# Altium project MotherBoard.PrjPcb
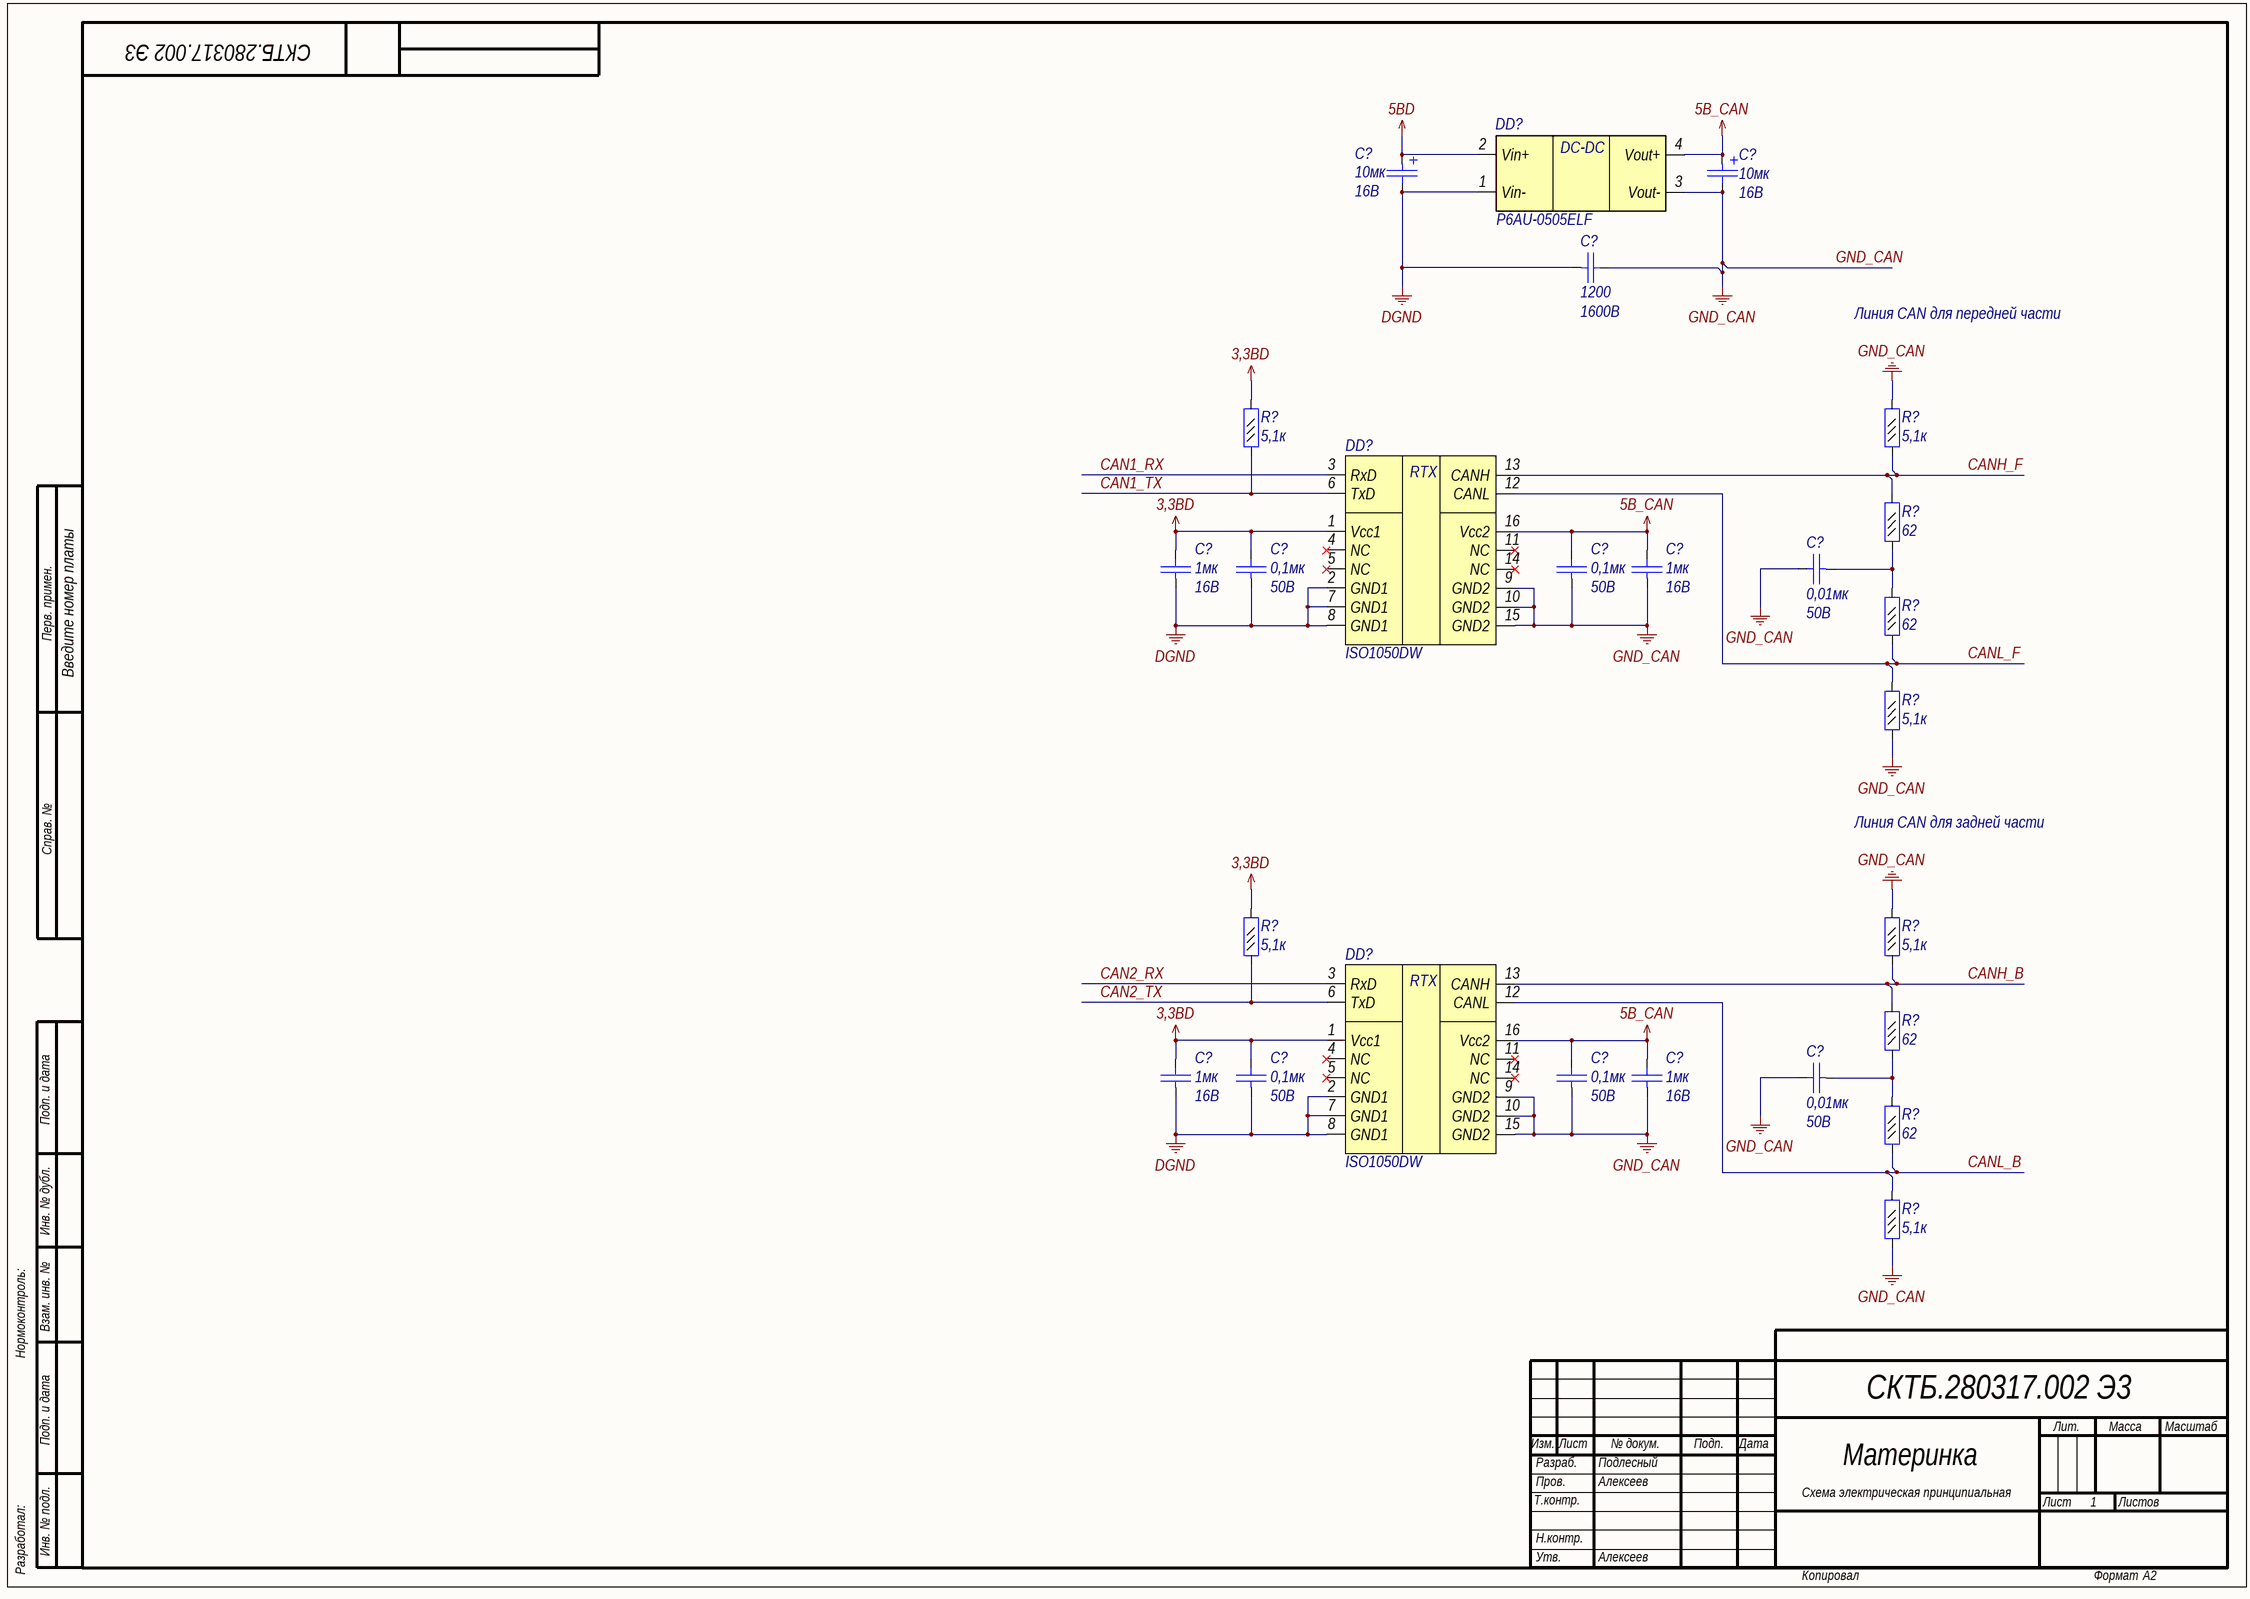
[diagram p0: MotherBoard_CAN.SchDoc]
2 sheets, 30 parts. Net scope: global (net labels, ports and power ports of the same name join across sheets).
Board file: MotherBoard.PcbDoc
Sheets:
  MotherBoard_CAN.SchDoc
  MotherBoard_RASP.SchDoc

## Sheet MotherBoard_CAN.SchDoc: Kapitoshka
size 594 x 420 mm; ApprovedBy: Алексеев; CheckedBy: Алексеев; DrawnBy: Подлесный; DocumentNumber: СКТБ.280317.002 Э3; SheetNumber: 1; Format: A2; DocumentType: Схема электрическая принципиальная; ImagePath: Введите номер платы

### Parts
(Parts that share a designator on the sheet are numbered #1, #2 ... from top to bottom, then left to right.)
C?#1  value 10мк  Voltage: 16В  [TANTAL CASE A]  (hidden comment: Capacitor_pol)
C?#2  value 10мк  Voltage: 16В  [TANTAL CASE A]  (hidden comment: Capacitor_pol)
C?#3  value 1200  Voltage: 1600B  [K78-2]  (hidden comment: Capacitor)
C?#4  value 0,01мк  Voltage: 50B  [C0603]  (hidden comment: Capacitor)
C?#5  value 1мк  Voltage: 16B  [C0603]  (hidden comment: Capacitor)
C?#6  value 0,1мк  Voltage: 50B  [C0603]  (hidden comment: Capacitor)
C?#7  value 0,1мк  Voltage: 50B  [C0603]  (hidden comment: Capacitor)
C?#8  value 1мк  Voltage: 16B  [C0603]  (hidden comment: Capacitor)
C?#9  value 0,01мк  Voltage: 50B  [C0603]  (hidden comment: Capacitor)
C?#10  value 1мк  Voltage: 16B  [C0603]  (hidden comment: Capacitor)
C?#11  value 0,1мк  Voltage: 50B  [C0603]  (hidden comment: Capacitor)
C?#12  value 0,1мк  Voltage: 50B  [C0603]  (hidden comment: Capacitor)
C?#13  value 1мк  Voltage: 16B  [C0603]  (hidden comment: Capacitor)
DD?#1  Part Number: P6AU-0505ELF  [SIP4]  (hidden comment: P6AU-xxxxELF)
DD?#2  (no value)  [SO16]
DD?#3  (no value)  [SO16]
R?#1  value 5,1к  [R0603]  (hidden comment: Resistor_0,062Вт)
R?#2  value 5,1к  [R0603]  (hidden comment: Resistor_0,062Вт)
R?#3  value 62  [R0603]  (hidden comment: Resistor_0,062Вт)
R?#4  value 62  [R0603]  (hidden comment: Resistor_0,062Вт)
R?#5  value 5,1к  [R0603]  (hidden comment: Resistor_0,062Вт)
R?#6  value 5,1к  [R0603]  (hidden comment: Resistor_0,062Вт)
R?#7  value 5,1к  [R0603]  (hidden comment: Resistor_0,062Вт)
R?#8  value 62  [R0603]  (hidden comment: Resistor_0,062Вт)
R?#9  value 62  [R0603]  (hidden comment: Resistor_0,062Вт)
R?#10  value 5,1к  [R0603]  (hidden comment: Resistor_0,062Вт)

### Nets
3,3BD: C?#5.2 C?#6.2 C?#10.2 C?#11.2 DD?#2.1(Vcc1) DD?#3.1(Vcc1) R?#1.2 R?#6.2
5B_CAN: C?#2.1 C?#7.2 C?#8.2 C?#12.2 C?#13.2 DD?#1.4(Vout+) DD?#2.16(Vcc2) DD?#3.16(Vcc2)
5BD: C?#1.1 DD?#1.2(Vin+)
DGND: C?#1.2 C?#3.1 C?#5.1 C?#6.1 C?#10.1 C?#11.1 DD?#1.1(Vin-) DD?#2.2(GND1) DD?#2.7(GND1) DD?#2.8(GND1) DD?#3.2(GND1) DD?#3.7(GND1) DD?#3.8(GND1)
GND_CAN: C?#2.2 C?#3.2 C?#4.2 C?#7.1 C?#8.1 C?#9.2 C?#12.1 C?#13.1 DD?#1.3(Vout-) DD?#2.9(GND2) DD?#2.10(GND2) DD?#2.15(GND2) DD?#3.9(GND2) DD?#3.10(GND2) DD?#3.15(GND2) R?#2.2 R?#5.1 R?#7.2 R?#10.1
CAN1_RX: DD?#2.3(RxD)
CAN1_TX: DD?#2.6(TxD) R?#1.1
CAN2_RX: DD?#3.3(RxD)
CAN2_TX: DD?#3.6(TxD) R?#6.1
CANH_B: DD?#3.13(CANH) R?#7.1 R?#8.2
CANH_F: DD?#2.13(CANH) R?#2.1 R?#3.2
CANL_B: DD?#3.12(CANL) R?#9.1 R?#10.2
CANL_F: DD?#2.12(CANL) R?#4.1 R?#5.2
NetC?#4_1: C?#4.1 R?#3.1 R?#4.2
NetC?#9_1: C?#9.1 R?#8.1 R?#9.2

Not connected (* = marked no-connect by the designer): DD?#2 4(NC)* 5(NC)* 11(NC)* 14(NC)*; DD?#3 4(NC)* 5(NC)* 11(NC)* 14(NC)*

### Notes on the sheet
- Линия CAN для передней части
- Перв. примен.
- Справ. №
- Линия CAN для задней части
- Подп. и дата
- Инв. № дубл.
- Нормоконтроль:
- Взам. инв. №
- Изм.
- Лист
- № докум.
- Подп.
- Дата
- Лит.
- Масса
- Масштаб
- Т.контр.
- Пров.
- Разраб.
- Материнка
- Листов
- Разработал:
- Инв. № подл.
- Н.контр.
- Утв.
- Копировал
- Формат
- (in symbol interf22) RTX
- (in symbol pwr52) DC-DC

### Library data of the parts
C?#1 C?#2 = cap199: Конденсатор полярный; Part Name: Tantal; Manufacture: Vishay; Part Number: 293D106X9016A2TE3; id: cap199
C?#3 = cap276: Конденсатор; Part Name: Film; Manufacture: Россия; Part Number: К78-2-1200пФ-1600В,10%; id: cap276; tga: 0,10%
C?#4 C?#9 = cap124: Конденсатор; Part Name: Ceramic; Manufacture: Murata; Part Number: GRM188R71H103K; id: cap124; TKE: X7R
C?#5 C?#8 C?#10 C?#13 = cap133: Конденсатор; Part Name: Ceramic; Manufacture: Murata; Part Number: GRM188R71C105KA12D**; id: cap133; TKE: X7R
C?#6 C?#7 C?#11 C?#12 = cap131: Конденсатор; Part Name: Ceramic; Manufacture: Murata; Part Number: GRM188R71H104KA93D; id: cap131; TKE: X7R
DD?#1 = pwr52: DC/DC преобразователь; Part Name: DC/DC Converter Isolated; Manufacturer: PEAK Electronics; id: pwr52; Input Voltage: 5B; Current: 200mA; Type: Isolated; Output Voltage: 5B
DD?#2 DD?#3 = interf22: Isolated CAN Transceiver; Manufacture: Texas Instruments; Number of Channel: 1; Type Supply: Single Polar; Current Consumption: 76mA; Power Supply: 3-5,5В/4,75-5,25В; id: interf22; Part Name: Isolated CAN Transceiver; Part Number: ISO1050DW
R?#1 R?#2 R?#5-R?#7 R?#10 = res480: Резистор; Manufacture: Yageo; Part Number: RC0603FR-075K1; id: res480; Accuracy: 0,01; Part Name: Resistor; Power: 0,062Вт
R?#3 R?#4 R?#8 R?#9 = res434: Резистор; Manufacture: Yageo; Part Number: RC0603FR-0762RL; id: res434; Accuracy: 0,01; Part Name: Resistor; Power: 0,062Вт

## Sheet MotherBoard_RASP.SchDoc
size 594 x 420 mm; DocumentNumber: Введите номер платы + Э3; SheetNumber: номер страницы; Format: A2
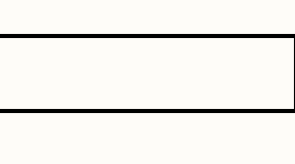
[diagram p1: MotherBoard_RASP.SchDoc, top left]
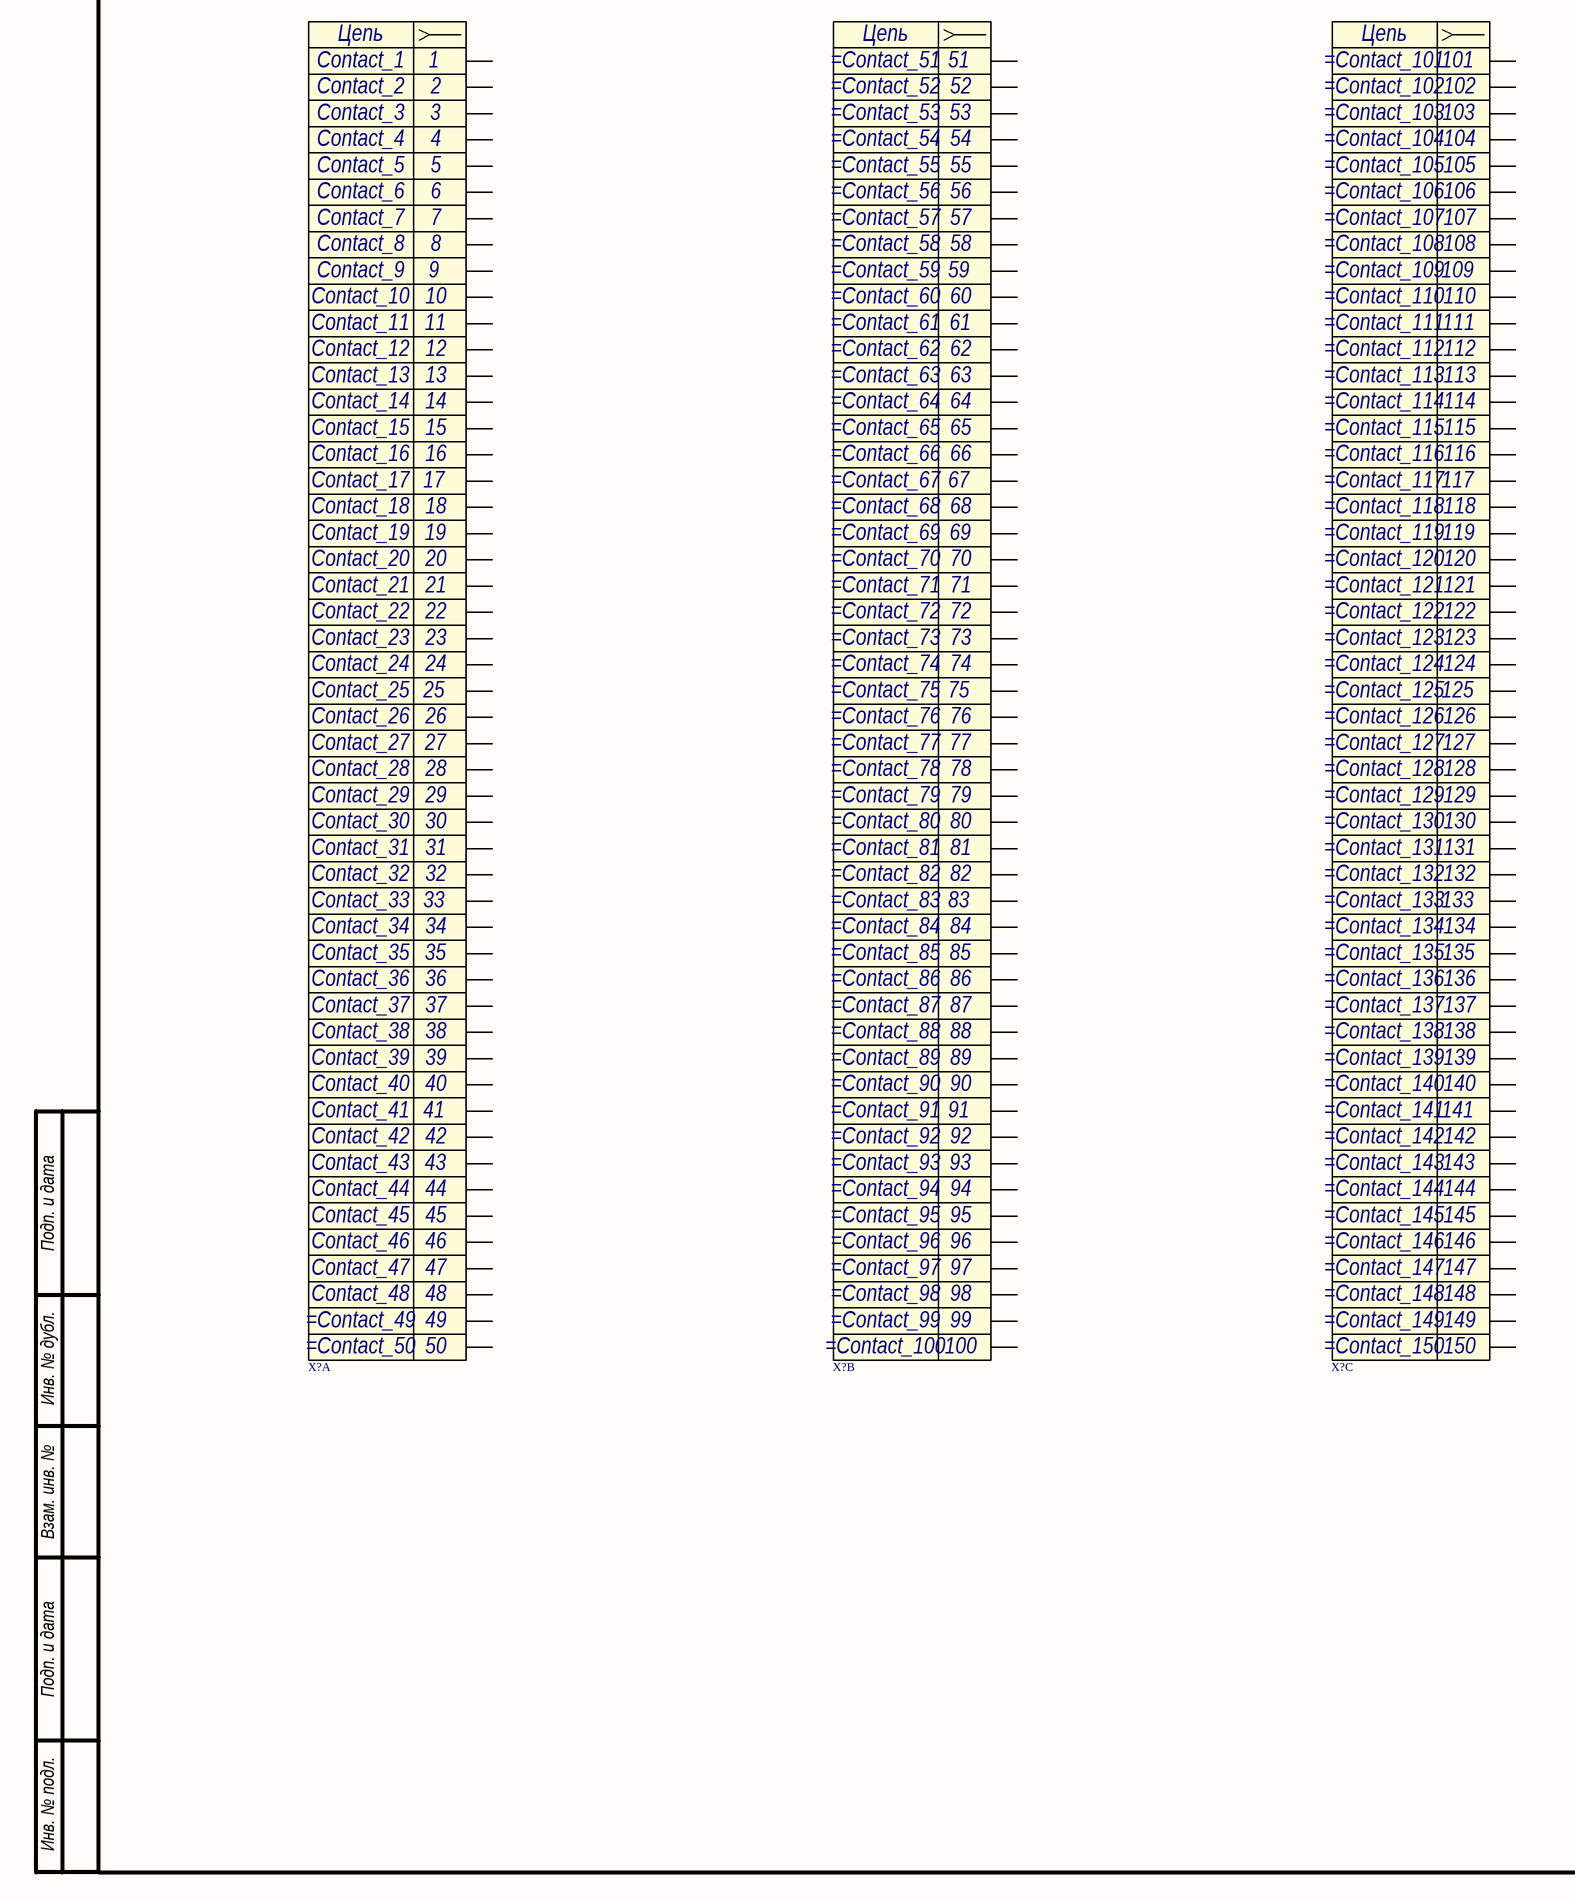
[diagram p2: MotherBoard_RASP.SchDoc, bottom left]
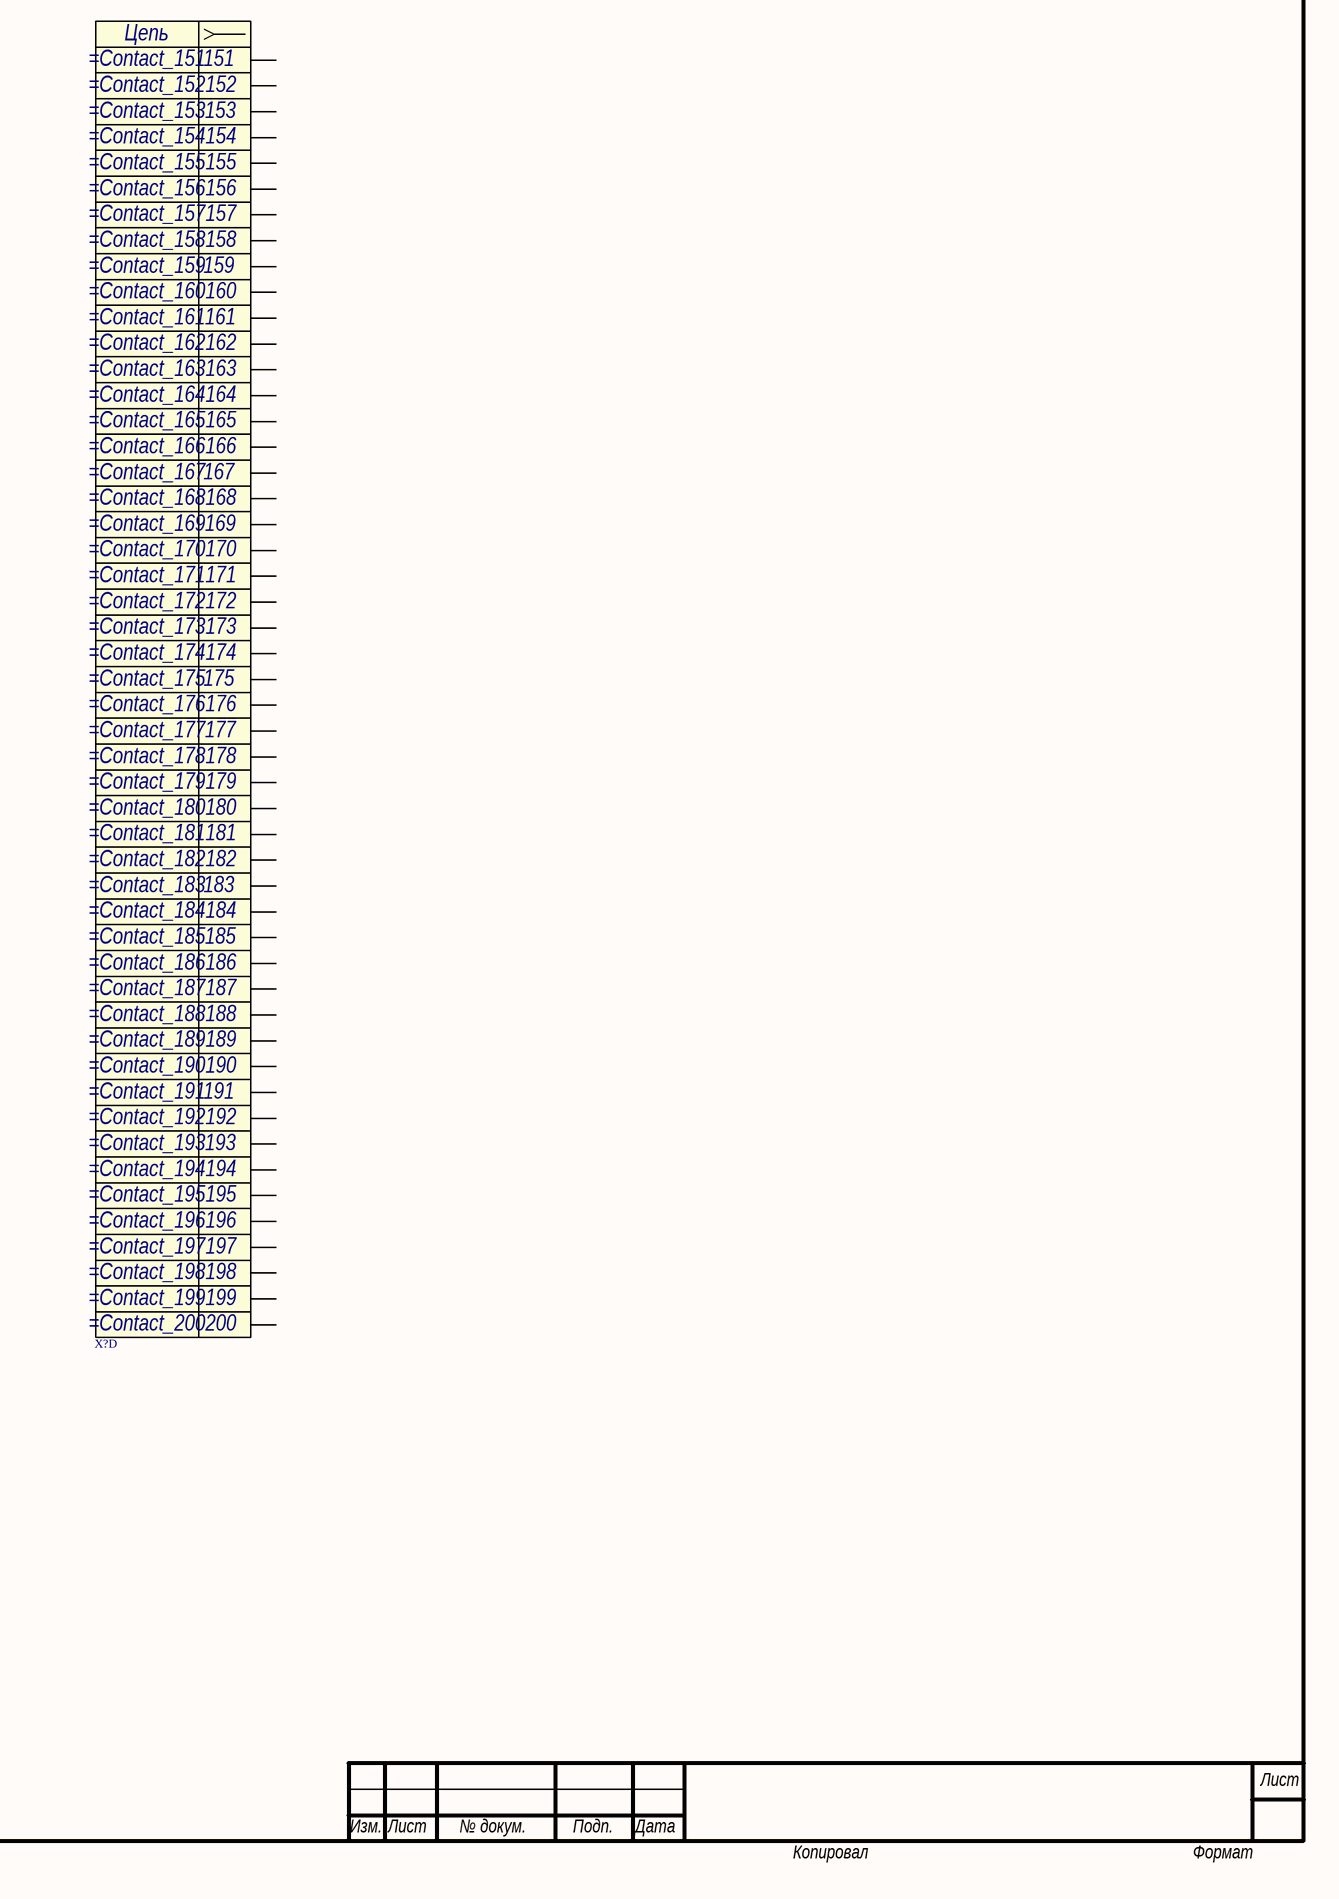
[diagram p3: MotherBoard_RASP.SchDoc, bottom right]

### Parts
(Parts that share a designator on the sheet are numbered #1, #2 ... from top to bottom, then left to right.)
X?#1  (no value)  [SODIMM 200P]  (part B of 4)
X?#2  (no value)  [SODIMM 200P]  (part C of 4)
X?#3  (no value)  [SODIMM 200P]  (part D of 4)
X?#4  (no value)  [SODIMM 200P]  (part A of 4)

### Nets

Not connected (* = marked no-connect by the designer): X?#1 51 52 53 54 55 56 57 58 59 60 61 62 63 64 65 66 67 68 69 70 71 72 73 74 75 76 77 78 79 80 81 82 83 84 85 86 87 88 89 90 91 92 93 94 95 96 97 98 99 100; X?#2 101 102 103 104 105 106 107 108 109 110 111 112 113 114 115 116 117 118 119 120 121 122 123 124 125 126 127 128 129 130 131 132 133 134 135 136 137 138 139 140 141 142 143 144 145 146 147 148 149 150; X?#3 151 152 153 154 155 156 157 158 159 160 161 162 163 164 165 166 167 168 169 170 171 172 173 174 175 176 177 178 179 180 181 182 183 184 185 186 187 188 189 190 191 192 193 194 195 196 197 198 199 200; X?#4 1 2 3 4 5 6 7 8 9 10 11 12 13 14 15 16 17 18 19 20 21 22 23 24 25 26 27 28 29 30 31 32 33 34 35 36 37 38 39 40 41 42 43 44 45 46 47 48 49 50

### Notes on the sheet
- Подп. и дата
- Инв. № дубл.
- Взам. инв. №
- Инв. № подл.
- Лист
- Изм.
- № докум.
- Подп.
- Дата
- Копировал
- Формат
- (in symbol connect90, part A) Цепь
- (in symbol connect90, part B) Цепь
- (in symbol connect90, part C) Цепь
- (in symbol connect90, part D) Цепь

### Library data of the parts
X?#1-X?#4 = connect90: Разъем - 5 конт. розетка; Part Name: DDR2 SODIMM connectors; F55: Contact_49; F56: Contact_50; F57: Contact_51; F58: Contact_52; F59: Contact_53; F60: Contact_54; F61: Contact_55; F62: Contact_56; F63: Contact_57; F64: Contact_58; F65: Contact_59; F66: Contact_60; F67: Contact_61; F68: Contact_62; F69: Contact_63; F70: Contact_64; F71: Contact_65; F72: Contact_66; F73: Contact_67; F74: Contact_68; F75: Contact_69; F76: Contact_70; F77: Contact_71; F78: Contact_72; F79: Contact_73; F80: Contact_74; F81: Contact_75; F82: Contact_76; F83: Contact_77; F84: Contact_78; F85: Contact_79; F86: Contact_80; F87: Contact_81; F88: Contact_82; F89: Contact_83; F90: Contact_84; F91: Contact_85; F92: Contact_86; F93: Contact_87; F94: Contact_88; F95: Contact_89; F96: Contact_90; F97: Contact_91; F98: Contact_92; F99: Contact_93; F100: Contact_94; F101: Contact_95; F102: Contact_96; F103: Contact_97; F104: Contact_98; F105: Contact_99; F106: Contact_100; F107: Contact_101; F108: Contact_102; F109: Contact_103; F110: Contact_104; F111: Contact_105; F112: Contact_106; F113: Contact_107; F114: Contact_108; F115: Contact_109; F116: Contact_110; F117: Contact_111; F118: Contact_112; F119: Contact_113; F120: Contact_114; F121: Contact_115; F122: Contact_116; F123: Contact_117; F124: Contact_118; F125: Contact_119; F126: Contact_120; F127: Contact_121; F128: Contact_122; F129: Contact_123; F130: Contact_124; F131: Contact_125; F132: Contact_126; F133: Contact_127; F134: Contact_128; F135: Contact_129; F136: Contact_130; F137: Contact_131; F138: Contact_132; F139: Contact_133; F140: Contact_134; F141: Contact_135; F142: Contact_136; F143: Contact_137; F144: Contact_138; F145: Contact_139; F146: Contact_140; F147: Contact_141; F148: Contact_142; F149: Contact_143; F150: Contact_144; F151: Contact_145; F152: Contact_146; F153: Contact_147; F154: Contact_148; F155: Contact_149; F156: Contact_150; F157: Contact_151; F158: Contact_152; F159: Contact_153; F160: Contact_154; F161: Contact_155; F162: Contact_156; F163: Contact_157; F164: Contact_158; F165: Contact_159; F166: Contact_160; F167: Contact_161; F168: Contact_162; F169: Contact_163; F170: Contact_164; F171: Contact_165; F172: Contact_166; F173: Contact_167; F174: Contact_168; F175: Contact_169; F176: Contact_170; F177: Contact_171; F178: Contact_172; F179: Contact_173; F180: Contact_174; F181: Contact_175; F182: Contact_176; F183: Contact_177; F184: Contact_178; F185: Contact_179; F186: Contact_180; F187: Contact_181; F188: Contact_182; F189: Contact_183; F190: Contact_184; F191: Contact_185; F192: Contact_186; F193: Contact_187; F194: Contact_188; F195: Contact_189; F196: Contact_190; F197: Contact_191; F198: Contact_192; F199: Contact_193; F200: Contact_194; F201: Contact_195; F202: Contact_196; F203: Contact_197; F204: Contact_198; F205: Contact_199; F206: Contact_200; Contact_1: Contact_1; Contact_2: Contact_2; Contact_3: Contact_3; Contact_4: Contact_4; Contact_5: Contact_5; Contact_6: Contact_6; id: connect90; Contact_7: Contact_7; Contact_8: Contact_8; Contact_9: Contact_9; Contact_10: Contact_10; Contact_11: Contact_11; Contact_12: Contact_12; Contact_13: Contact_13; Contact_14: Contact_14; Contact_15: Contact_15; Contact_16: Contact_16; Contact_17: Contact_17; Contact_18: Contact_18; Contact_19: Contact_19; Contact_20: Contact_20; Contact_21: Contact_21; Contact_22: Contact_22; Contact_23: Contact_23; Contact_24: Contact_24; Contact_25: Contact_25; Contact_26: Contact_26; Contact_27: Contact_27; Contact_28: Contact_28; Contact_29: Contact_29; Contact_30: Contact_30; Contact_31: Contact_31; Contact_32: Contact_32; Contact_33: Contact_33; Contact_34: Contact_34; Contact_35: Contact_35; Contact_36: Contact_36; Contact_37: Contact_37; Contact_38: Contact_38; Contact_39: Contact_39; Contact_40: Contact_40; Contact_41: Contact_41; Contact_42: Contact_42; Contact_43: Contact_43; Contact_44: Contact_44; Contact_45: Contact_45; Contact_46: Contact_46; Contact_47: Contact_47; Contact_48: Contact_48